# Altium schematic sheet Sheet1.SchDoc
size A; SheetNumber: 1; SheetTotal: 1
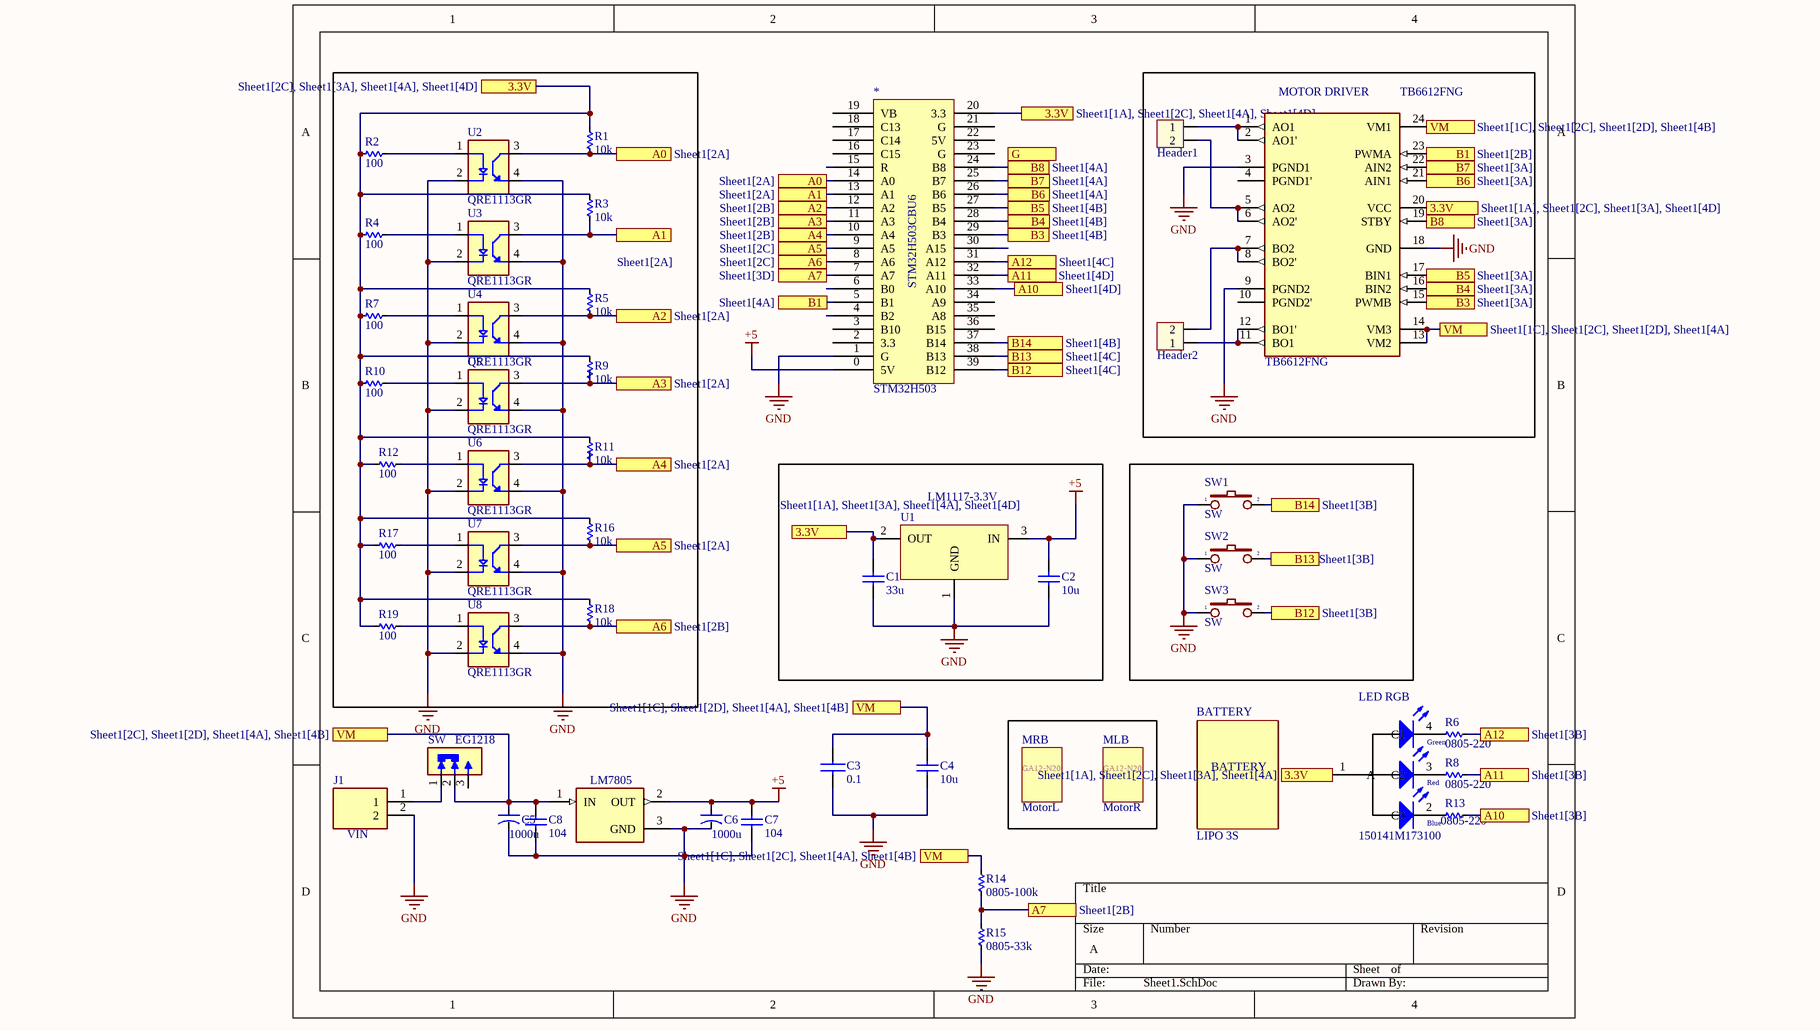
[diagram p0: Sheet1.SchDoc]

## Parts
*  STM32H503  [STM32F103]
BATTERY  LIPO 3S  [BATTERY]
C1  33u  [C1206]
C2  10u  [C1206]
C3  0.1  [0805]
C4  10u  [C1206]
C5  1000u  [CAP-ALU-SMD-G]
C6  1000u  [CAP-ALU-SMD-G]
C7  104  [0805]
C8  104  [0805]
H1  Header1  [XH2.54M-2]
H2  Header2  [XH2.54M-2]
J1  VIN  [TE_282834-2]
LED_RGB  150141M173100  [LED RGB 3528]
LM7805  (no value)  [TO-263]
ML  MotorR  [GA12_N20]  (part B of 2)
MOTOR_DRIVER  TB6612FNG  [SSOP24]
MR  MotorL  [GA12_N20]  (part B of 2)
R1  10k  [RES-SMD-0805]
R2  100  [RES-SMD-0805]
R3  10k  [RES-SMD-0805]
R4  100  [RES-SMD-0805]
R5  10k  [RES-SMD-0805]
R6  0805-220  [RES-SMD-0805]
R7  100  [RES-SMD-0805]
R8  0805-220  [RES-SMD-0805]
R9  10k  [RES-SMD-0805]
R10  100  [RES-SMD-0805]
R11  10k  [RES-SMD-0805]
R12  100  [RES-SMD-0805]
R13  0805-220  [RES-SMD-0805]
R14  0805-100k  [RES-SMD-0805]
R15  0805-33k  [RES-SMD-0805]
R16  10k  [RES-SMD-0805]
R17  100  [RES-SMD-0805]
R18  10k  [RES-SMD-0805]
R19  100  [RES-SMD-0805]
SW  EG1218  [SW_EG1218]
SW1  SW  [SW1-SMD]
SW2  SW  [SW1-SMD]
SW3  SW  [SW1-SMD]
U1  LM1117-3.3V  [SOT223]
U2  QRE1113GR  [SOIC180P460X187-4N]
U3  QRE1113GR  [SOIC180P460X187-4N]
U4  QRE1113GR  [SOIC180P460X187-4N]
U5  QRE1113GR  [SOIC180P460X187-4N]
U6  QRE1113GR  [SOIC180P460X187-4N]
U7  QRE1113GR  [SOIC180P460X187-4N]
U8  QRE1113GR  [SOIC180P460X187-4N]

## Ports
3.3V (see Sheet1[1A], Sheet1[2C], Sheet1[3A], Sheet1[4A]), 3.3V (see Sheet1[1A], Sheet1[2C], Sheet1[3A], Sheet1[4D]), 3.3V (see Sheet1[1A], Sheet1[2C], Sheet1[4A], Sheet1[4D]), 3.3V (see Sheet1[1A], Sheet1[3A], Sheet1[4A], Sheet1[4D]), 3.3V (see Sheet1[2C], Sheet1[3A], Sheet1[4A], Sheet1[4D]), A0 (see Sheet1[2A]), A1 (see Sheet1[2A]), A2 (see Sheet1[2A]), A2 (see Sheet1[2B]), A3 (see Sheet1[2A]), A3 (see Sheet1[2B]), A4 (see Sheet1[2A]), A4 (see Sheet1[2B]), A5 (see Sheet1[2A]), A5 (see Sheet1[2C]), A6 (see Sheet1[2B]), A6 (see Sheet1[2C]), A7 (see Sheet1[2B]), A7 (see Sheet1[3D]), A10 (see Sheet1[3B]), A10 (see Sheet1[4D]), A11 (see Sheet1[3B]), A11 (see Sheet1[4D]), A12 (see Sheet1[3B]), A12 (see Sheet1[4C]), B1 (see Sheet1[2B]), B1 (see Sheet1[4A]), B3 (see Sheet1[3A]), B3 (see Sheet1[4B]), B4 (see Sheet1[3A]), B4 (see Sheet1[4B]), B5 (see Sheet1[3A]), B5 (see Sheet1[4B]), B6 (see Sheet1[3A]), B6 (see Sheet1[4A]), B7 (see Sheet1[3A]), B7 (see Sheet1[4A]), B8 (see Sheet1[3A]), B8 (see Sheet1[4A]), B12 (see Sheet1[3B]), B12 (see Sheet1[4C]), B13 (see Sheet1[3B]), B13 (see Sheet1[4C]), B14 (see Sheet1[3B]), B14 (see Sheet1[4B]), G, VM (see Sheet1[1C], Sheet1[2C], Sheet1[2D], Sheet1[4A]), VM (see Sheet1[1C], Sheet1[2C], Sheet1[2D], Sheet1[4B]), VM (see Sheet1[1C], Sheet1[2C], Sheet1[4A], Sheet1[4B]), VM (see Sheet1[1C], Sheet1[2D], Sheet1[4A], Sheet1[4B]), VM (see Sheet1[2C], Sheet1[2D], Sheet1[4A], Sheet1[4B])

## Nets
+5: *.0(5V) C2.2 C6.1 C7.2 LM7805.2(OUT) U1.3(IN)
GND: *.1(G) C1.1 C2.1 C3.2 C4.1 C5.2 C6.2 C7.1 C8.1 J1.2 LM7805.3(GND) MOTOR_DRIVER.3(PGND1) MOTOR_DRIVER.9(PGND2) MOTOR_DRIVER.18(GND) R15.2 SW1.1 SW2.1 SW3.1 U1.1(GND) U2.2(C) U2.4(ET) U3.2(C) U3.4(ET) U4.2(C) U4.4(ET) U5.2(C) U5.4(ET) U6.2(C) U6.4(ET) U7.2(C) U7.4(ET) U8.2(C) U8.4(ET)
3.3V: *.20(3.3) C1.2 LED_RGB.1(A) MOTOR_DRIVER.20(VCC) R1.1 R2.2 R3.1 R4.2 R5.1 R7.2 R9.1 R10.2 R11.1 R12.2 R16.1 R17.2 R18.1 R19.2 U1.2(OUT) ; port 3.3V
A0: *.14(A0) R1.2 U2.3(CT) ; port A0
A1: *.13(A1) R3.2 U3.3(CT) ; port A1
A2: *.12(A2) R5.2 U4.3(CT) ; port A2
A3: *.11(A3) R9.2 U5.3(CT) ; port A3
A4: *.10(A4) R11.2 U6.3(CT) ; port A4
A5: *.9(A5) R16.2 U7.3(CT) ; port A5
A6: *.8(A6) R18.2 U8.3(CT) ; port A6
A7: *.7(A7) R14.2 R15.1 ; port A7
A10: *.33(A10) R13.1 ; port A10
A11: *.32(A11) R8.1 ; port A11
A12: *.31(A12) R6.1 ; port A12
B1: *.5(B1) MOTOR_DRIVER.23(PWMA) ; port B1
B3: *.29(B3) MOTOR_DRIVER.15(PWMB) ; port B3
B4: *.28(B4) MOTOR_DRIVER.16(BIN2) ; port B4
B5: *.27(B5) MOTOR_DRIVER.17(BIN1) ; port B5
B6: *.26(B6) MOTOR_DRIVER.21(AIN1) ; port B6
B7: *.25(B7) MOTOR_DRIVER.22(AIN2) ; port B7
B8: *.24(B8) MOTOR_DRIVER.19(STBY) ; port B8
B12: *.39(B12) SW3.2 ; port B12
B13: *.38(B13) SW2.2 ; port B13
B14: *.37(B14) SW1.2 ; port B14
VM: C3.1 C4.2 C5.1 C8.2 LM7805.1(IN) MOTOR_DRIVER.13(VM2) MOTOR_DRIVER.14(VM3) MOTOR_DRIVER.24(VM1) R14.1 SW.2(COM) ; port VM
NetH1_1: H1.1 MOTOR_DRIVER.1(AO1) MOTOR_DRIVER.2(AO1')
NetH1_2: H1.2 MOTOR_DRIVER.5(AO2) MOTOR_DRIVER.6(AO2')
NetH2_1: H2.1 MOTOR_DRIVER.11(BO1) MOTOR_DRIVER.12(BO1')
NetH2_2: H2.2 MOTOR_DRIVER.7(BO2) MOTOR_DRIVER.8(BO2')
NetJ1_1: J1.1 SW.1(NC)
NetLED_RGB_2: LED_RGB.2(C3) R13.2
NetLED_RGB_3: LED_RGB.3(C2) R8.2
NetLED_RGB_4: LED_RGB.4(C1) R6.2
NetR2_1: R2.1 U2.1(A)
NetR4_1: R4.1 U3.1(A)
NetR7_1: R7.1 U4.1(A)
NetR10_1: R10.1 U5.1(A)
NetR12_1: R12.1 U6.1(A)
NetR17_1: R17.1 U7.1(A)
NetR19_1: R19.1 U8.1(A)

Not connected (* = marked no-connect by the designer): * 2(3.3) 3(B10) 4(B2) 6(B0) 15(R) 16(C15) 17(C14) 18(C13) 19(VB) 21(G) 22(5V) 23(G) 30(A15) 34(A9) 35(A8) 36(B15); MOTOR_DRIVER 4(PGND1') 10(PGND2'); SW 3(NO)

## Notes on the sheet
- (in symbol Component_1, part B) GA12-N20
- (in symbol LED RGB SMD) Green; Red; Blue
- (in symbol STM32H503) STM32H503CBU6

## Library data of the parts
C1 C2 C4 = Cap SMD 1206
C3 = CAP 0805: Right: 20; Bottom: 10
C5 C6 = CN-ALU-SMD: Polarized Capacitor (Axial); Published: 8-Jun-2000; LatestRevisionDate: 17-Jul-2002; LatestRevisionNote: Re-released for DXP Platform.; PackageReference: POLAR0.8; Publisher: Altium Limited
C7 C8 = Cap 104_SMD: Capacitor (Semiconductor SIM Model); Value: 0.1uF; Published: 8-Jun-2000; LatestRevisionDate: 17-Jul-2002; LatestRevisionNote: Re-released for DXP Platform.; PackageReference: C1206; Publisher: Altium Limited
H1 H2 = Header 2P 2.54 Duc Thang: Cắm; Ten_Linh_Kien: Header 2P XH2.54-2P Đực Thẳng; Don_Vi: Con; Ma_Hang: MH001283; Chung_Loai: Cắm
J1 = 282834-2: MF: {'manufacturer': u'TE Connectivity'}; Value: *; MP: 282834-2; Availability: Unavailable; Package: None; Price: None
LED_RGB = LED RGB SMD: SMD Full-Color Top LED, WL-SFTW, Red & Green & Blue; Manufacturer: Würth Elektronik eiSos GmbH; PartNo: 150141M173100; ComponentLink1Description: Manufacturer; ComponentLink1URL: http://www.we-online.de; Created by: Christin Otto; Created Date: June 2013; ComponentLink2Description: Datasheet; ComponentLink2URL: http://katalog.we-online.com/led/datasheet/150141M173100.pdf; Color: Red & Green & Blue
LM7805 = LM78xx: Linear Voltage Regulator IC Positive Fixed 1 Output 1.5A D2PAK
ML MR = Component_1
MOTOR_DRIVER = TB6612FNG: - Motor Driver Power MOSFET Parallel 24-SSOP; MF: Toshiba; SnapEDA_Link: https://www.snapeda.com/parts/TB6612FNG/Toshiba/view-part/?ref=snap; Package: None; Value: *; MP: TB6612FNG; Check_prices: https://www.snapeda.com/parts/TB6612FNG/Toshiba/view-part/?ref=eda
R1-R19 = Res-SMD: Resistor; Manufacturer: Generic Components; Class: Passive; Published: 08/06/2000; Publisher: Altium Hobart Technology Centre
SW = EG1218: Slide Switch, EG Series, SPDT, Non-Shorting, ON-ON, 200mA DC, 30VDC, PC Pin | E-Switch EG1218; SnapEDA_Link: https://www.snapeda.com/parts/EG1218/E-Switch/view-part/?ref=snap; Package: None; Value: *; MF: E-Switch; MP: EG1218; Check_prices: https://www.snapeda.com/parts/EG1218/E-Switch/view-part/?ref=eda
SW1-SW3 = SW2: Switch button 2 pin; Value: SW chip 2 pin
U1 = LM1117: 800mA Low-Dropout Linear Regulator; Creator: Nguyen Ba Bien; Website: http://group3i.net
U2-U8 = QRE1113GR: Reflective Optical Sensor 0.039 (1mm) 4-SMD, Gull Wing; MF: ON Semiconductor; Package: ARUSM-313-4 ON Semiconductor; Price: None; Check_prices: https://www.snapeda.com/parts/QRE1113GR/Onsemi/view-part/?ref=eda; Value: *; SnapEDA_Link: https://www.snapeda.com/parts/QRE1113GR/Onsemi/view-part/?ref=snap; MP: QRE1113GR; Availability: In Stock; Purchase-URL: https://pricing.snapeda.com/search/part/QRE1113GR/?ref=eda